# EAGLE schematic pnode (EAGLE 7.3.0)
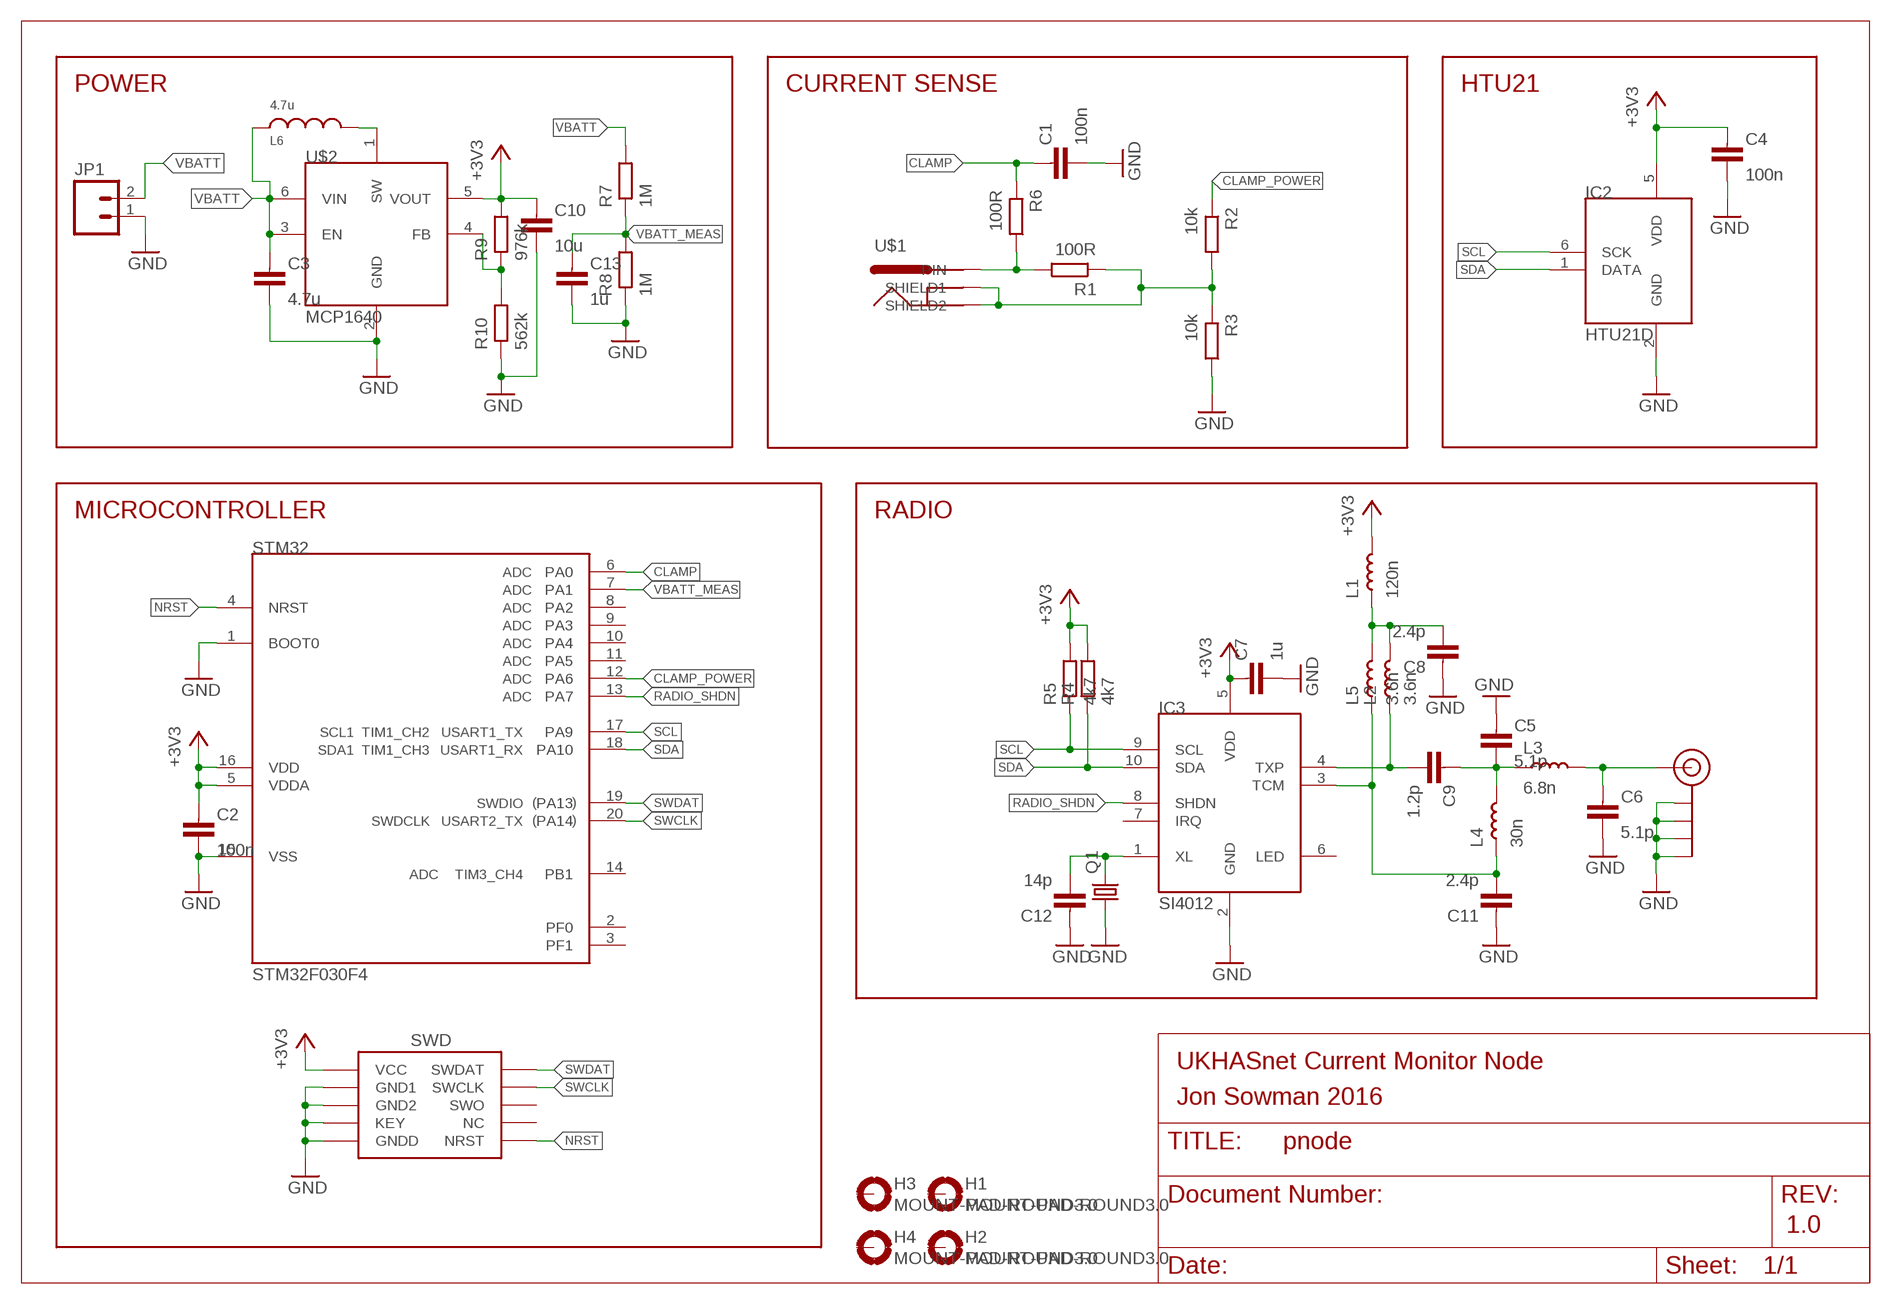
[diagram p0: schematic, sheet 1]

## Parts
C1  100n  CAPACITOR0603-N  [C0603-N]
C2  100n  CAPACITOR0603-N  [C0603-N]
C3  4.7u  CAPACITOR0603-N  [C0603-N]
C4  100n  CAPACITOR0603-N  [C0603-N]
C5  5.1p  CAPACITOR0603-N  [C0603-N]
C6  5.1p  CAPACITOR0603-N  [C0603-N]
C7  1u  CAPACITOR0603-N  [C0603-N]
C8  2.4p  CAPACITOR0603-N  [C0603-N]
C9  1.2p  CAPACITOR0603-N  [C0603-N]
C10  10u  CAPACITOR0603-N  [C0603-N]
C11  2.4p  CAPACITOR0603-N  [C0603-N]
C12  14p  CAPACITOR0603-N  [C0603-N]
C13  1u  CAPACITOR0603-N  [C0603-N]
H1  MOUNT-PAD-ROUND3.0  [3,0-PAD]
H2  MOUNT-PAD-ROUND3.0  [3,0-PAD]
H3  MOUNT-PAD-ROUND3.0  [3,0-PAD]
H4  MOUNT-PAD-ROUND3.0  [3,0-PAD]
IC2  HTU21D  [DFN6-L]
IC3  SI4012  [MSOP10]
J$1  SMA_EDGE  [SMA-EDGE]
JP1  M02PTH  [1X02]
L1  120n  INDUCTOR0603-N  [L0603-N]
L2  3.6n  INDUCTOR0402-N  [L0402-N]
L3  6.8n  INDUCTOR0402-N  [L0402-N]
L4  30n  INDUCTOR0402-N  [L0402-N]
L5  3.6n  INDUCTOR0402-N  [L0402-N]
L6  4.7u  BOURNS_SDE0403A  [BOURNS_SDE0403A]
Q1  CRYSTALHC49S  [HC49/S]
R1  100R  RESISTOR0603-N  [R0603-N]
R2  10k  RESISTOR0603-N  [R0603-N]
R3  10k  RESISTOR0603-N  [R0603-N]
R4  4k7  RESISTOR0603-N  [R0603-N]
R5  4k7  RESISTOR0603-N  [R0603-N]
R6  100R  RESISTOR0603-N  [R0603-N]
R7  1M  RESISTOR0603-N  [R0603-N]
R8  1M  RESISTOR0603-N  [R0603-N]
R9  976k  RESISTOR0603-N  [R0603-N]
R10  562k  RESISTOR0603-N  [R0603-N]
STM32  STM32F030F4  [TSSOP20]
U$1  13MM_DC_JACKPTH  [13MM_DC_JACK]
U$2  MCP1640  [SOT23-6]
U$3  SWD_PTH_SHROUD  [SWD_PTH_SHROUD]

## Nets
+3V3: C2.1 C4.1 C7.1 C10.1 IC2.5(VDD) IC3.5(VDD) L1.2 R4.2 R5.2 R9.2 STM32.5(VDDA) STM32.16(VDD) U$2.5(VOUT) U$3.1(VCC)
CLAMP: C1.1 R6.1 STM32.6(PA0)
CLAMP_POWER: R2.1 STM32.12(PA6)
GND: C1.2 C2.2 C3.2 C4.2 C5.1 C6.2 C7.2 C8.1 C10.2 C11.1 C12.1 C13.2 IC2.2(GND) IC3.2(GND) J$1.GND@0(GND) J$1.GND@1(GND) J$1.GND@2(GND) J$1.GND@3(GND) JP1.1 Q1.1 R3.2 R8.1 R10.1 STM32.1(BOOT0) STM32.15(VSS) U$2.2(GND) U$3.3(GND1) U$3.5(GND2) U$3.7(KEY) U$3.9(GNDD)
N$1: R1.2 R6.2 U$1.1(PIN)
N$2: R1.1 R2.2 R3.1 U$1.2(SHIELD1) U$1.3(SHIELD2)
N$3: R9.1 R10.2 U$2.4(FB)
N$4: C8.2 L1.1 L2.2 L5.2
N$5: C12.2 IC3.1(XL) Q1.2
N$6: L6.P$2 U$2.1(SW)
N$7: C5.2 C9.1 L3.1 L4.2
N$8: C11.2 IC3.3(TCM) L4.1 L5.1
N$9: C9.2 IC3.4(TXP) L2.1
N$10: C6.1 J$1.SIG(SIGNAL) L3.2
NRST: STM32.4(NRST) U$3.10(NRST)
RADIO_SHDN: IC3.8(SHDN) STM32.13(PA7)
SCL: IC2.6(SCK) IC3.9(SCL) R5.1 STM32.17(PA9)
SDA: IC2.1(DATA) IC3.10(SDA) R4.1 STM32.18(PA10)
SWCLK: STM32.20(PA14) U$3.4(SWCLK)
SWDAT: STM32.19(PA13) U$3.2(SWDAT)
VBATT: C3.1 JP1.2 L6.P$1 R7.2 U$2.3(EN) U$2.6(VIN)
VBATT_MEAS: C13.1 R7.1 R8.2 STM32.7(PA1)
Unconnected: H1.B3,0(MOUNT) H2.B3,0(MOUNT) H3.B3,0(MOUNT) H4.B3,0(MOUNT) IC3.6(LED) IC3.7(IRQ) STM32.2(PF0) STM32.3(PF1) STM32.8(PA2) STM32.9(PA3) STM32.10(PA4) STM32.11(PA5) STM32.14(PB1) U$3.6(SWO) U$3.8(NC)

## Notes on the sheet
- POWER | CURRENT SENSE | HTU21
- MICROCONTROLLER | RADIO
- UKHASnet Current Monitor Node
- Jon Sowman 2016
- 1.0

## Library data of the parts
C1-C13 = passives-7351:CAPACITOR
H1-H4 = dtb:MOUNT-PAD-ROUND: MOUNTING PAD, round
IC2 = Mine:HTU21D
IC3 = Mine:SI4012
J$1 = jonsowman:SMA_EDGE: SMA Antenna Connector End launch SMA connector. The paste layer has been removed so that the connector can be hand soldered onto the board after reflow.
JP1 = Mine:M02: Header 2 Standard 2-pin 0.1" header. Use with straight break away headers (SKU : PRT-00116), right angle break away headers (PRT-00553), swiss pins (PRT-00743), machine pins (PRT-00117), and female headers (PRT-00115). Molex polarized connector foot print use with SKU : PRT-08233 with associated crimp pins and housings.
L1-L5 = passives-7351:INDUCTOR
L6 = jonsowman:BOURNS_SDE0403A
Q1 = crystal:CRYSTAL: CRYSTAL; OC_FARNELL: 1667008; OC_NEWARK: unknown
R1-R10 = passives-7351:RESISTOR
STM32 = dtb:STM32F030F4
U$1 = jonsowman:13MM_DC_JACK
U$2 = ukhas:MCP1640
U$3 = jonsowman:SWD_PTH_SHROUD